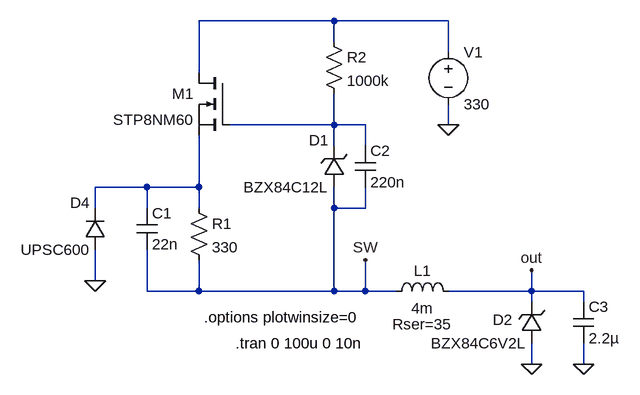
[diagram p0: schematic unusually simple regulator.asc]
unusually simple regulator.asc, the LTspice schematic file:
Version 4
SHEET 1 880 680
WIRE 256 -16 48 -16
WIRE 432 -16 256 -16
WIRE 256 16 256 -16
WIRE 432 32 432 -16
WIRE 48 64 48 -16
WIRE 256 144 256 96
WIRE 256 144 96 144
WIRE 304 144 256 144
WIRE 432 144 432 112
WIRE 256 176 256 144
WIRE 304 176 304 144
WIRE -32 240 -112 240
WIRE 48 240 48 160
WIRE 48 240 -32 240
WIRE -112 272 -112 240
WIRE -32 272 -32 240
WIRE 48 272 48 240
WIRE 256 272 256 240
WIRE 304 272 304 240
WIRE 304 272 256 272
WIRE -112 384 -112 336
WIRE -32 400 -32 336
WIRE 48 400 48 352
WIRE 48 400 -32 400
WIRE 256 400 256 272
WIRE 256 400 48 400
WIRE 304 400 304 352
WIRE 304 400 256 400
WIRE 352 400 304 400
WIRE 560 400 560 368
WIRE 560 400 432 400
WIRE 640 400 560 400
WIRE 560 416 560 400
WIRE 640 416 640 400
WIRE 560 512 560 480
WIRE 640 512 640 480
FLAG 432 144 0
FLAG 560 512 0
FLAG -112 384 0
FLAG 560 368 out
FLAG 304 352 SW
FLAG 640 512 0
SYMBOL nmos 96 64 M0
SYMATTR InstName M1
SYMATTR Value STP8NM60
SYMBOL res 32 256 R0
SYMATTR InstName R1
SYMATTR Value 330
SYMBOL cap -48 272 R0
SYMATTR InstName C1
SYMATTR Value 22n
SYMBOL cap 288 176 R0
SYMATTR InstName C2
SYMATTR Value 220n
SYMBOL zener 272 240 R180
WINDOW 0 24 72 Left 0
WINDOW 3 24 0 Left 0
SYMATTR InstName D1
SYMATTR Value BZX84C12L
SYMBOL ind 336 416 R270
WINDOW 0 32 56 VTop 0
WINDOW 3 5 56 VBottom 0
WINDOW 39 -19 56 VBottom 0
SYMATTR InstName L1
SYMATTR Value 4m
SYMATTR SpiceLine Rser=35
SYMBOL zener 576 480 R180
WINDOW 0 45 36 Left 0
WINDOW 3 24 0 Left 0
SYMATTR InstName D2
SYMATTR Value BZX84C6V2L
SYMBOL res 240 0 R0
SYMATTR InstName R2
SYMATTR Value 1000k
SYMBOL voltage 432 16 R0
WINDOW 123 0 0 Left 0
WINDOW 39 0 0 Left 0
SYMATTR InstName V1
SYMATTR Value 330
SYMBOL diode -96 336 R180
WINDOW 0 24 72 Left 0
WINDOW 3 24 0 Left 0
SYMATTR InstName D4
SYMATTR Value UPSC600
SYMBOL cap 624 416 R0
SYMATTR InstName C3
SYMATTR Value 2.2µ
SYMATTR SpiceLine V=6.3 Irms=0 Rser=9 MTBF=0 Lser=0 mfg="AVX" pn="TAJA225M006" type="Tantalum" ppPkg=1
TEXT 104 480 Left 0 !.tran 0 100u 0 10n
TEXT 56 440 Left 0 !.options plotwinsize=0

The netlist it stands for:
* unusually simple regulator.asc
M1 N001 N002 N003 N003 STP8NM60
R1 N003 SW 330
C1 N003 SW 22n
C2 N002 SW 220n
D1 SW N002 BZX84C12L
L1 SW out 4m Rser=35
D2 0 out BZX84C6V2L
R2 N001 N002 1000k
V1 N001 0 330
D4 0 N003 UPSC600
C3 out 0 2.2µ V=6.3 Irms=0 Rser=9 MTBF=0 Lser=0 mfg="AVX" pn="TAJA225M006" type="Tantalum" ppPkg=1
.model D D
.lib standard.dio
.model NMOS NMOS
.model PMOS PMOS
.lib standard.mos
.tran 0 100u 0 10n
.options plotwinsize=0
.backanno
.end